# Altium schematic sheet LoRa_Shild.SchDoc
size 431 x 279 mm; SheetNumber: 1; SheetTotal: 1; ENG_APP_DATE: --/--/--; DSN_APP_DATE: --/--/--; CHK_APP_DATE: --/--/--
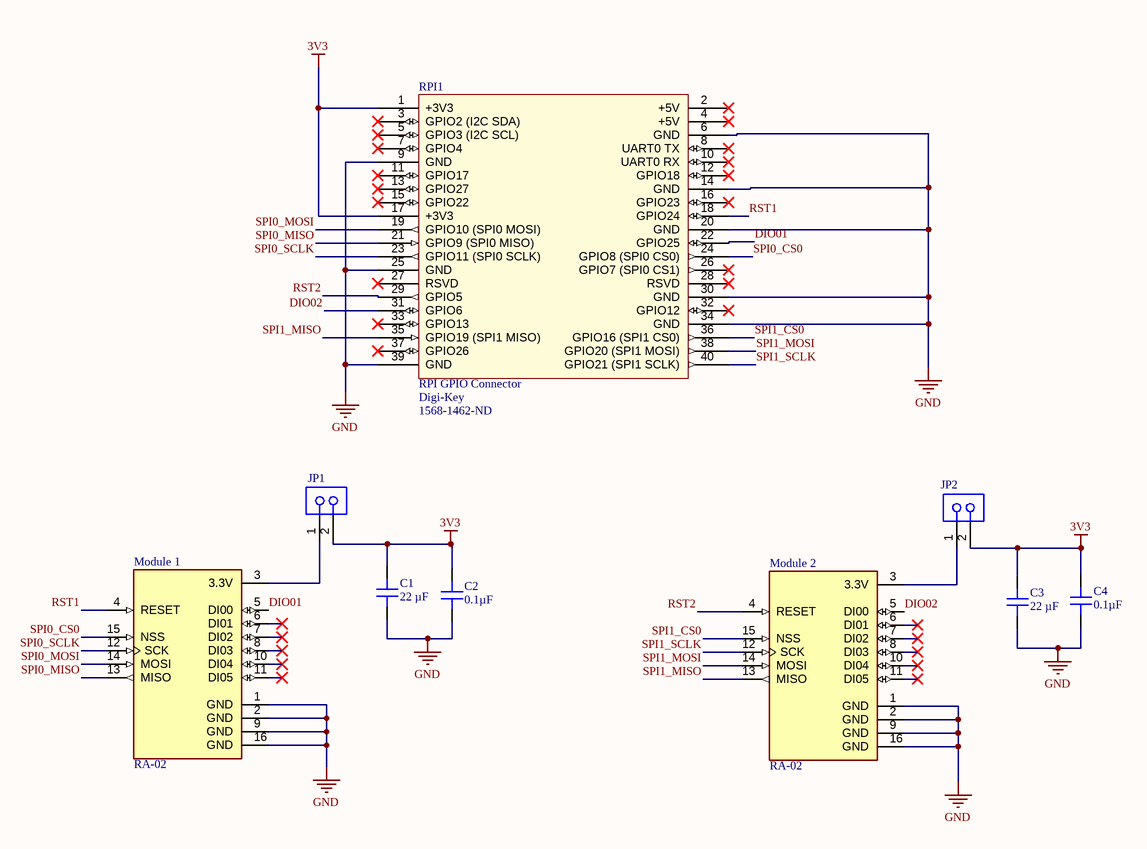
[diagram p0: LoRa_Shild.SchDoc]

## Parts
C1  22 µF  [CAP 0805_2012]
C2  0.1µF  [CAP 0805_2012]
C3  22 µF  [CAP 0805_2012]
C4  0.1µF  [CAP 0805_2012]
JP1  61300211821  [61300211821]  (value not drawn)
JP2  61300211821  [61300211821]  (value not drawn)
Module_1  RA-02  [RA-02]
Module_2  RA-02  [RA-02]
RPI1  RPI GPIO Connector  Supplier 1: Digi-Key  Supplier Part Number 1: 1568-1462-ND  [rpi]

## Nets
3V3: C1.2 C2.2 C3.2 C4.2 JP1.2 JP2.2 RPI1.1(+3V3) RPI1.17(+3V3)
GND: C1.1 C2.1 C3.1 C4.1 Module_1.1(GND) Module_1.2(GND) Module_1.9(GND) Module_1.16(GND) Module_2.1(GND) Module_2.2(GND) Module_2.9(GND) Module_2.16(GND) RPI1.6(GND) RPI1.9(GND) RPI1.14(GND) RPI1.20(GND) RPI1.25(GND) RPI1.30(GND) RPI1.34(GND) RPI1.39(GND)
DIO01: Module_1.5(DI00) RPI1.22(GPIO25)
DIO02: Module_2.5(DI00) RPI1.31(GPIO6)
RST1: Module_1.4(RESET) RPI1.18(GPIO24)
RST2: Module_2.4(RESET) RPI1.29(GPIO5)
SPI0_CS0: Module_1.15(NSS) RPI1.24(GPIO8_(SPI0_CS0))
SPI0_MISO: Module_1.13(MISO) RPI1.21(GPIO9_(SPI0_MISO))
SPI0_MOSI: Module_1.14(MOSI) RPI1.19(GPIO10_(SPI0_MOSI))
SPI0_SCLK: Module_1.12(SCK) RPI1.23(GPIO11_(SPI0_SCLK))
SPI1_CS0: Module_2.15(NSS) RPI1.36(GPIO16_(SPI1_CS0))
SPI1_MISO: Module_2.13(MISO) RPI1.35(GPIO19_(SPI1_MISO))
SPI1_MOSI: Module_2.14(MOSI) RPI1.38(GPIO20_(SPI1_MOSI))
SPI1_SCLK: Module_2.12(SCK) RPI1.40(GPIO21_(SPI1_SCLK))
NetJP1_1: JP1.1 Module_1.3(3.3V)
NetJP2_1: JP2.1 Module_2.3(3.3V)

Not connected (* = marked no-connect by the designer): Module_1 6(DI01)* 7(DI02)* 8(DI03)* 10(DI04)* 11(DI05)*; Module_2 6(DI01)* 7(DI02)* 8(DI03)* 10(DI04)* 11(DI05)*; RPI1 2(+5V)* 3(GPIO2_(I2C_SDA))* 4(+5V)* 5(GPIO3_(I2C_SCL))* 7(GPIO4)* 8(UART0_TX)* 10(UART0_RX)* 11(GPIO17)* 12(GPIO18)* 13(GPIO27)* 15(GPIO22)* 16(GPIO23)* 26(GPIO7_(SPI0_CS1))* 27(RSVD)* 28(RSVD)* 32(GPIO12)* 33(GPIO13)* 37(GPIO26)*

## Notes on the sheet
- DWG. NO.
- REV.
- SHT.
- THIS DOCUMENT AND THE DATA DISCLOSED HEREIN OR HEREWITH IS THE PROPERTY OF ALTIUM LIMITED AND MAY BE FREELY DISTRIBUTED IN WHOLE. NO RIGHTS ARE RESERVED OR EXPRESS OR IMPLIED WARANTEE GIVEN.
- REVISION
- DESCRIPTION
- DATE
- APPROVED
- ENG:
- APPROVALS
- PROJECT
- DSN:
- CHK:
- REFERENCE DOCUMENTS
- PROJECT REVISION:
- TITLE
- DOCUMENT REVISION:
- DESIGN ITEM:
- BOM:
- FAB DWG:
- PCB DWG:
- ASSY DWG:
- SCALE:
- SIZE
- B
- CAGE CODE
- FILE NAME
- DWG NO.
- SHEET
- OF
- REV

## Library data of the parts
C1 C3 = CL21A226KOQNNNG: CAP CER 22UF 16V X5R 0805; manufacturer: Samsung Electro-Mechanics; Tolerance: ±10%; Part Number: CL21A226KOQNNNG; Capacitance: 22 µF; Applications: General Purpose; componentlink1description: Datasheet; componentlink1url: //media.digikey.com/pdf/Data%20Sheets/Samsung%20PDFs/CL21A226KOQNNNG_Spec.pdf; componentlink2description: DigiKey Link; componentlink2url: https://www.digikey.com/en/products/detail/samsung-electro-mechanics/CL21A226KOQNNNG/3894433; Device Package: 0805 (2012 Metric); lastupdated: 2/9/2024 8:16:07 PM; Lifecycle Status: Active; Minimum Order: 1; Mounting Type: Surface Mount, MLCC; Operating Temperature: -55°C ~ 85°C; Package / Case: 0805 (2012 Metric); packaging: TapeAndReel; partid: 3000; Part Status: Active; price: 0.06; series: CL; Size / Dimension: 0.079" L x 0.049" W (2.00mm x 1.25mm); Supplier 1: DigiKey; Supplier Part Number 1: 1276-7092-1-ND; Temperature Coefficient: X5R; Thickness (Max): 0.055" (1.40mm); value: 22 µF; Voltage - Rated: 16V
C2 C4 = LD055C104KAB2A: CAP CER 0.1UF 50V X7R 0805; manufacturer: AVX Corporation; Tolerance: ±10%; Part Number: LD055C104KAB2A; Capacitance: 0.1µF; Applications: General Purpose; componentlink1description: Datasheet; componentlink1url: http://datasheets.avx.com/LD-Series.pdf; componentlink2description: DigiKey Link; componentlink2url: http://digikey.com/product-detail/en/avx-corporation/LD055C104KAB2A/478-4931-1-ND/1858877; Device Package: 0805 (2012 Metric); lastupdated: 9/2/2020 1:04:40 AM; Lifecycle Status: Active; Minimum Order: 1; Mounting Type: Surface Mount, MLCC; Operating Temperature: -55°C ~ 125°C; Package / Case: 0805 (2012 Metric); packaging: TapeAndReel; partid: 3356; Part Status: Active; price: 0.16; series: LD; Size / Dimension: 0.079" L x 0.049" W (2.01mm x 1.25mm); Supplier 1: DigiKey; Supplier Part Number 1: 478-4931-1-ND; Temperature Coefficient: X7R; Thickness (Max): 0.037" (0.94mm); value: 0.1µF; Voltage - Rated: 50V
JP1 JP2 = 61300211821: WR-PHD Socket Header, THT, Vertical, pitch 2.54mm, 1 Row, 2P; Manufacturer: Wurth Elektronik; Contact Resistance: 20mOhm; Rated Current: 3A; Working Voltage: 250V; Withstanding Voltage: 500V; Manufacturer Part Number: 61300211821; Category: Board-to-Board Connectors; Match Code: WR-PHD; ComponentLink1Description: Website Link; ComponentLink1URL: https://www.we-online.com/redexpert/article/61300211821?ad; ComponentLink2Description: Datasheet Link; ComponentLink2URL: https://www.we-online.com/redexpert/spec/61300211821?ad; Mount: Through Hole; Operating Temperature Max: 125°C; Operating Temperature Min: -40°C; Packaging: Tray; Gender: Socket Header; Number of Pins: 2; Number of Rows: 1; Orientation: Vertical; Pitch: 2.54mm
Module_1 Module_2 = CMP-005-000000-1: General ISM < 1GHz LoRaâ„¢ Transceiver Module 410MHz ~ 525MHz Antenna Not Included, I-PEX Surface Mount; MF: Ai-Thinker; Check_prices: https://www.snapeda.com/parts/RA-02/AI-Thinker/view-part/?ref=eda; Availability: Not in stock; SnapEDA_Link: https://www.snapeda.com/parts/RA-02/AI-Thinker/view-part/?ref=snap; Component Type: Standard; Pin Count: 16; MP: RA-02; Design Item ID: RA-02; Package: None; Source: RA-02.SchLib; Price: None; Value: *
RPI1 = rpi connector: GPIO Header for Raspberry Pi A+/B+/Pi 2/Pi 3 - 2x20; Manufacturer: SparkFun Electronics; Manufacturer Part Number: PRT-14017; Nils Minor: author; nilsminor@web.de: mail; RoHS: RoHS Compliant; Category: Development Boards, Kits, Programmers; Stock 1: 150; Pricing 1: 1=1.84 (EUR); Part Status: Active; Accessory Type: Connector; For Use With/Related Products: Raspberry Pi; ComponentLink1URL: https://cdn.sparkfun.com/datasheets/Dev/RaspberryPi/12313.pdf; ComponentLink1Description: https://cdn.sparkfun.com/datasheets/Dev/RaspberryPi/12313.pdf